# EAGLE design lightsaber (EAGLE 9.6.2)
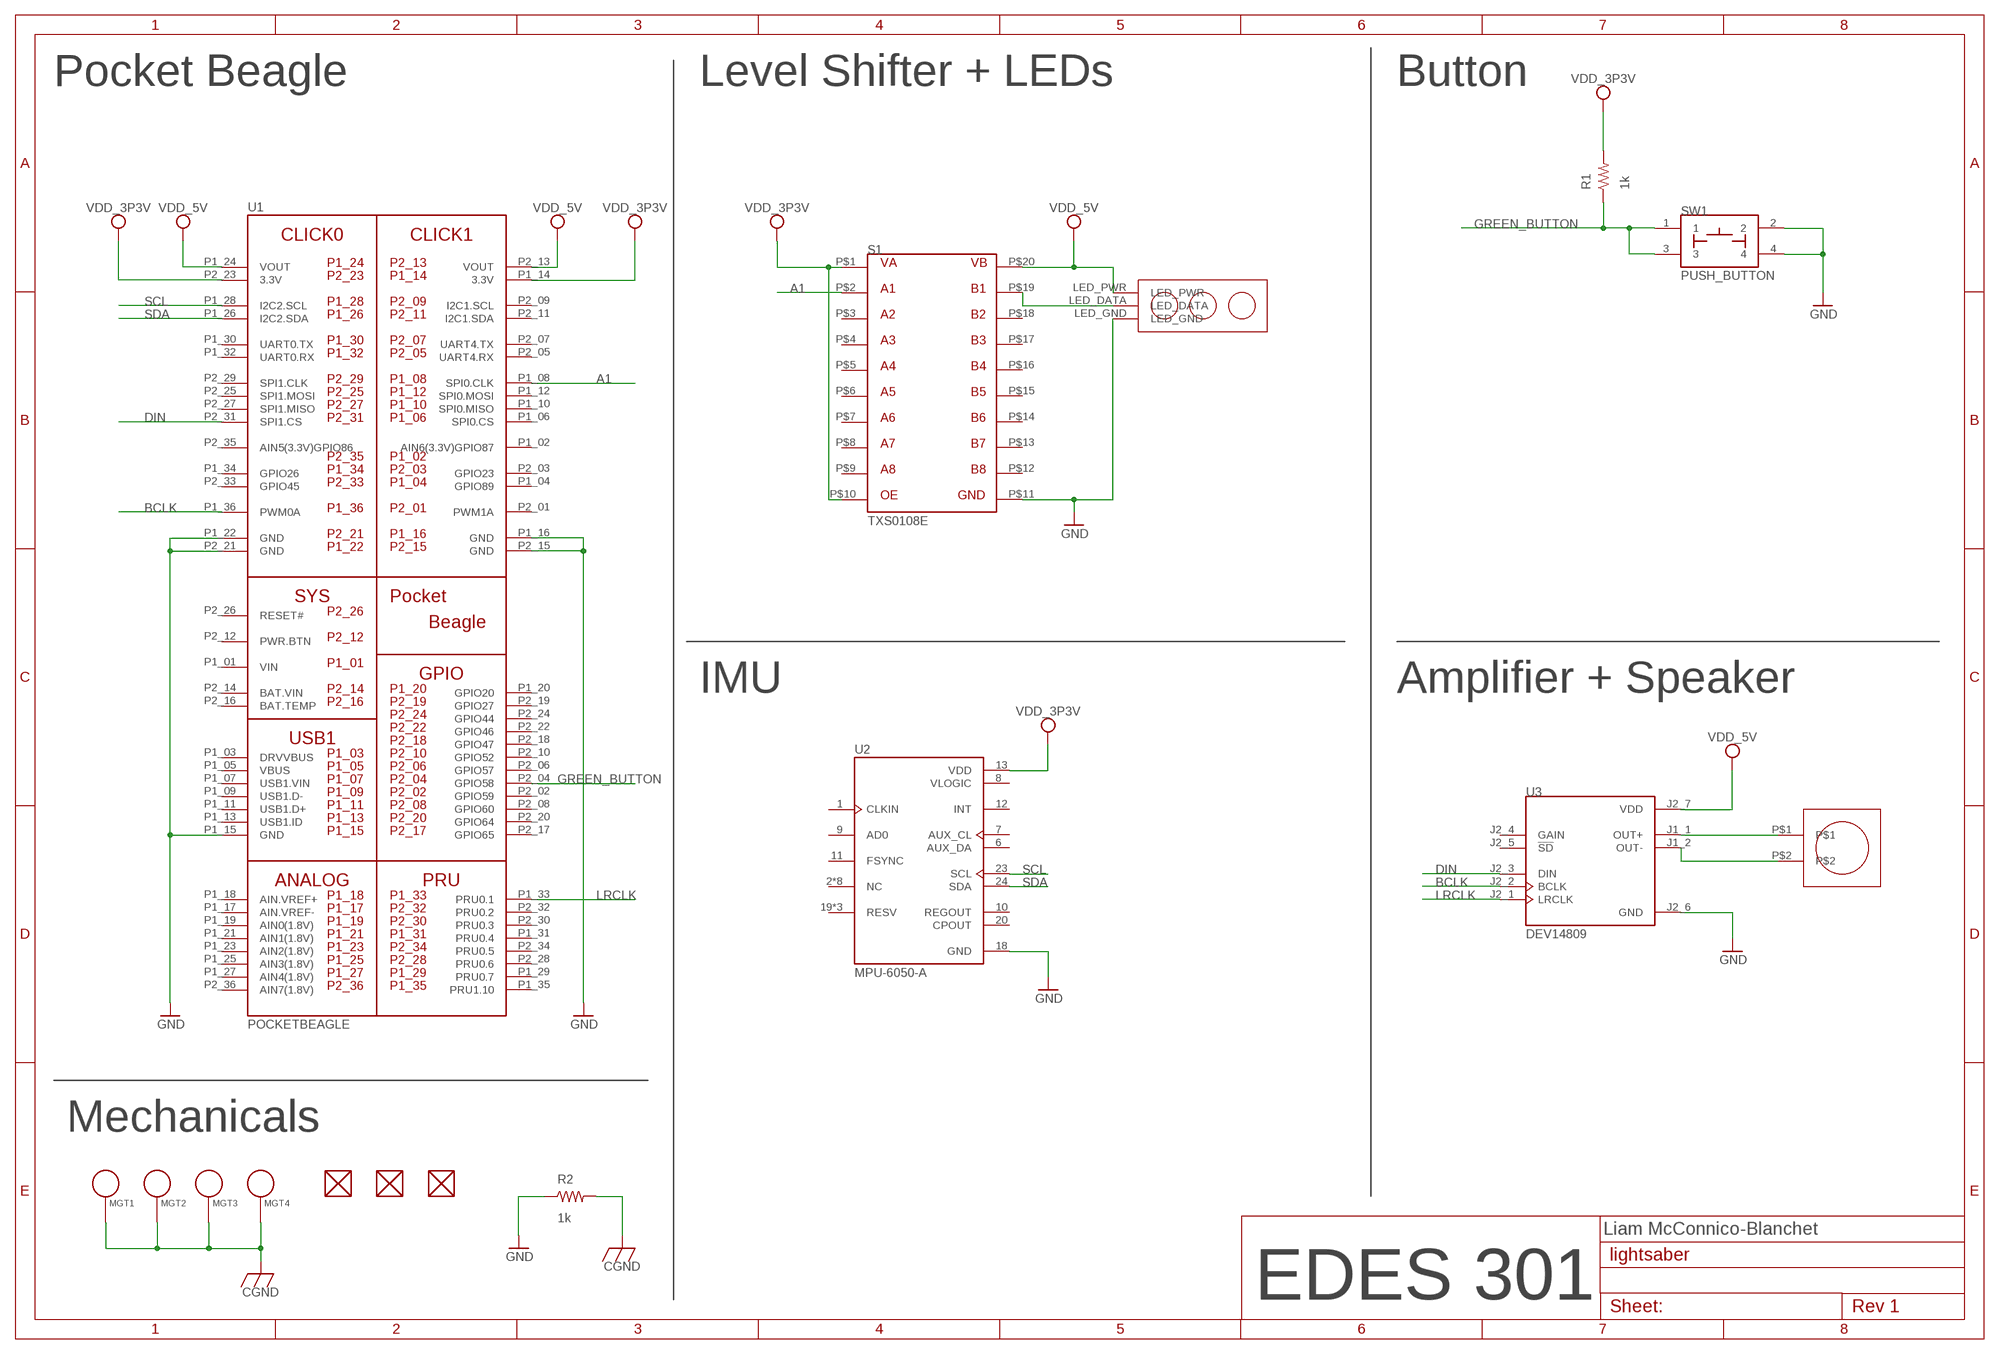
[diagram p0: schematic, sheet 1]

## Parts
FUD1  FIDUCIAL  [FIDUCIAL_40MIL]
FUD2  FIDUCIAL  [FIDUCIAL_40MIL]
FUD3  FIDUCIAL  [FIDUCIAL_40MIL]
MGT1  MOUNTING_HOLE  [MOUNTING_HOLE]
MGT2  MOUNTING_HOLE  [MOUNTING_HOLE]
MGT3  MOUNTING_HOLE  [MOUNTING_HOLE]
MGT4  MOUNTING_HOLE  [MOUNTING_HOLE]
R1  1k  R_R0603  [R0603]
R2  1k  R_R0603  [R0603]
S1  TXS0108E  [TXS0108E]
SW1  PUSH_BUTTON  [BUTTON_12.5MM]
U1  POCKETBEAGLE  [POCKETBEAGLE]
U2  MPU-6050-A  [QFN50P400X400X95-24N]
U3  DEV14809  [MODULE_DEV14809]
U$1  LED_STRIP  [LED_STRIP]
U$2  SPEAKER  [SPEAKER]

## Nets
A1: S1.P$2 U1.P1_08(SPI0.CLK)
BCLK: U1.P1_36(PWM0A) U3.J2_2(BCLK)
CGND: MGT1.P$1 MGT2.P$1 MGT3.P$1 MGT4.P$1 R2.2
DIN: U1.P2_31(SPI1.CS) U3.J2_3(DIN)
GND: R2.1 S1.P$11 SW1.2 SW1.4 U1.P1_15(GND) U1.P1_16(GND) U1.P1_22(GND) U1.P2_15(GND) U1.P2_21(GND) U2.18(GND) U3.J2_6(GND) U$1.LED_GND
GREEN_BUTTON: R1.1 SW1.1 SW1.3 U1.P2_04(GPIO58)
LRCLK: U1.P1_33(PRU0.1) U3.J2_1(LRCLK)
N$1: U3.J1_1(OUT+) U$2.P$1
N$2: U3.J1_2(OUT-) U$2.P$2
N$3: S1.P$19 U$1.LED_DATA
SCL: U1.P1_28(I2C2.SCL) U2.23(SCL)
SDA: U1.P1_26(I2C2.SDA) U2.24(SDA)
VDD_3P3V: R1.2 S1.P$1 S1.P$10 U1.P1_14(3.3V) U1.P2_23(3.3V) U2.13(VDD)
VDD_5V: S1.P$20 U1.P1_24(VOUT) U1.P2_13(VOUT) U3.J2_7(VDD) U$1.LED_PWR
Unconnected: FUD1.P$1 FUD2.P$1 FUD3.P$1 S1.P$3 S1.P$4 S1.P$5 S1.P$6 S1.P$7 S1.P$8 S1.P$9 S1.P$12 S1.P$13 S1.P$14 S1.P$15 S1.P$16 S1.P$17 S1.P$18 U1.P1_02(AIN6(3.3V)GPIO87) U1.P1_03(DRVVBUS) U1.P1_04(GPIO89) U1.P1_05(VBUS) U1.P1_06(SPI0.CS) U1.P1_07(USB1.VIN) U1.P1_09(USB1.D-) U1.P1_10(SPI0.MISO) U1.P1_11(USB1.D+) U1.P1_12(SPI0.MOSI) U1.P1_13(USB1.ID) U1.P1_17(AIN.VREF-) U1.P1_18(AIN.VREF+) U1.P1_19(AIN0(1.8V)) U1.P1_20(GPIO20) U1.P1_21(AIN1(1.8V)) U1.P1_23(AIN2(1.8V)) U1.P1_25(AIN3(1.8V)) U1.P1_27(AIN4(1.8V)) U1.P1_29(PRU0.7) U1.P1_30(UART0.TX) U1.P1_31(PRU0.4) U1.P1_32(UART0.RX) U1.P1_34(GPIO26) U1.P1_35(PRU1.10) U1.P2_01(PWM1A) U1.P2_02(GPIO59) U1.P2_03(GPIO23) U1.P2_05(UART4.RX) U1.P2_06(GPIO57) U1.P2_07(UART4.TX) U1.P2_08(GPIO60) U1.P2_09(I2C1.SCL) U1.P2_10(GPIO52) U1.P2_11(I2C1.SDA) U1.P2_12(PWR.BTN) U1.P2_16(BAT.TEMP) U1.P2_17(GPIO65) U1.P2_18(GPIO47) U1.P2_19(GPIO27) U1.P2_20(GPIO64) U1.P2_22(GPIO46) U1.P2_24(GPIO44) U1.P2_25(SPI1.MOSI) U1.P2_26(RESET#) U1.P2_27(SPI1.MISO) U1.P2_28(PRU0.6) U1.P2_29(SPI1.CLK) U1.P2_30(PRU0.3) U1.P2_32(PRU0.2) U1.P2_33(GPIO45) U1.P2_34(PRU0.5) U1.P2_35(AIN5(3.3V)GPIO86) U1.P2_36(AIN7(1.8V)) U2.1(CLKIN) U2.2(NC) U2.3(NC) U2.4(NC) U2.5(NC) U2.6(AUX_DA) U2.7(AUX_CL) U2.9(AD0) U2.10(REGOUT) U2.11(FSYNC) U2.12(INT) U2.14(NC) U2.15(NC) U2.16(NC) U2.17(NC) U2.19(RESV) U2.20(CPOUT) U2.21(RESV) U2.22(RESV) U3.J2_4(GAIN) U3.J2_5(!SD)

## Notes on the sheet
- Pocket Beagle | Level Shifter + LEDs | Button
- IMU | Amplifier + Speaker
- Mechanicals
- Liam McConnico-Blanchet
- EDES 301

## Power pins joined to a net without a drawn wire
BAT.VIN: U1.P2_14(BAT.VIN)
VIN: U1.P1_01(VIN)
VLOGIC: U2.8(VLOGIC)

## Library data of the parts
FUD1-FUD3 = combo_lock (1):FIDUCIAL
MGT1-MGT4 = combo_lock (1):MOUNTING_HOLE: Chassis Mounting Hole w/GND connection ability
R1 R2 = combo_lock (1):R_: RESISTOR, American symbol
S1 = Project 2:TXS0108E: Level shifter: TXS0108E
SW1 = combo_lock (1):PUSH_BUTTON
U1 = combo_lock (1):POCKETBEAGLE
U2 = Project 2:MPU-6050-A: Check availability <https://pricing.snapeda.com/parts/MPU-6050-A/TDK%20InvenSense/view-part?ref=eda>; AVAILABILITY: In Stock; CHECK_PRICES: https://www.snapeda.com/parts/MPU-6050-A/TDK/view-part/?ref=eda; DESCRIPTION: MOTION TRACKING DEVICE; MF: TDK InvenSense; MP: MPU-6050-A; PACKAGE: QFN-24 InvenSense; PRICE: None; SNAPEDA_LINK: https://www.snapeda.com/parts/MPU-6050-A/TDK/view-part/?ref=snap
U3 = Project 2:DEV14809: Check availability <https://pricing.snapeda.com/parts/DEV14809/Sparkfun%20Electronics/view-part?ref=eda>; AVAILABILITY: In Stock; CHECK_PRICES: https://www.snapeda.com/parts/DEV14809/SparkFun/view-part/?ref=eda; DESCRIPTION: MAX98357A Audio Interface Audio - Platform Evaluation Expansion Board; MF: Sparkfun Electronics; MP: DEV14809; PACKAGE: None; PRICE: None; SNAPEDA_LINK: https://www.snapeda.com/parts/DEV14809/SparkFun/view-part/?ref=snap
U$1 = Project 2:LED_STRIP
U$2 = Project 2:SPEAKER

## Board
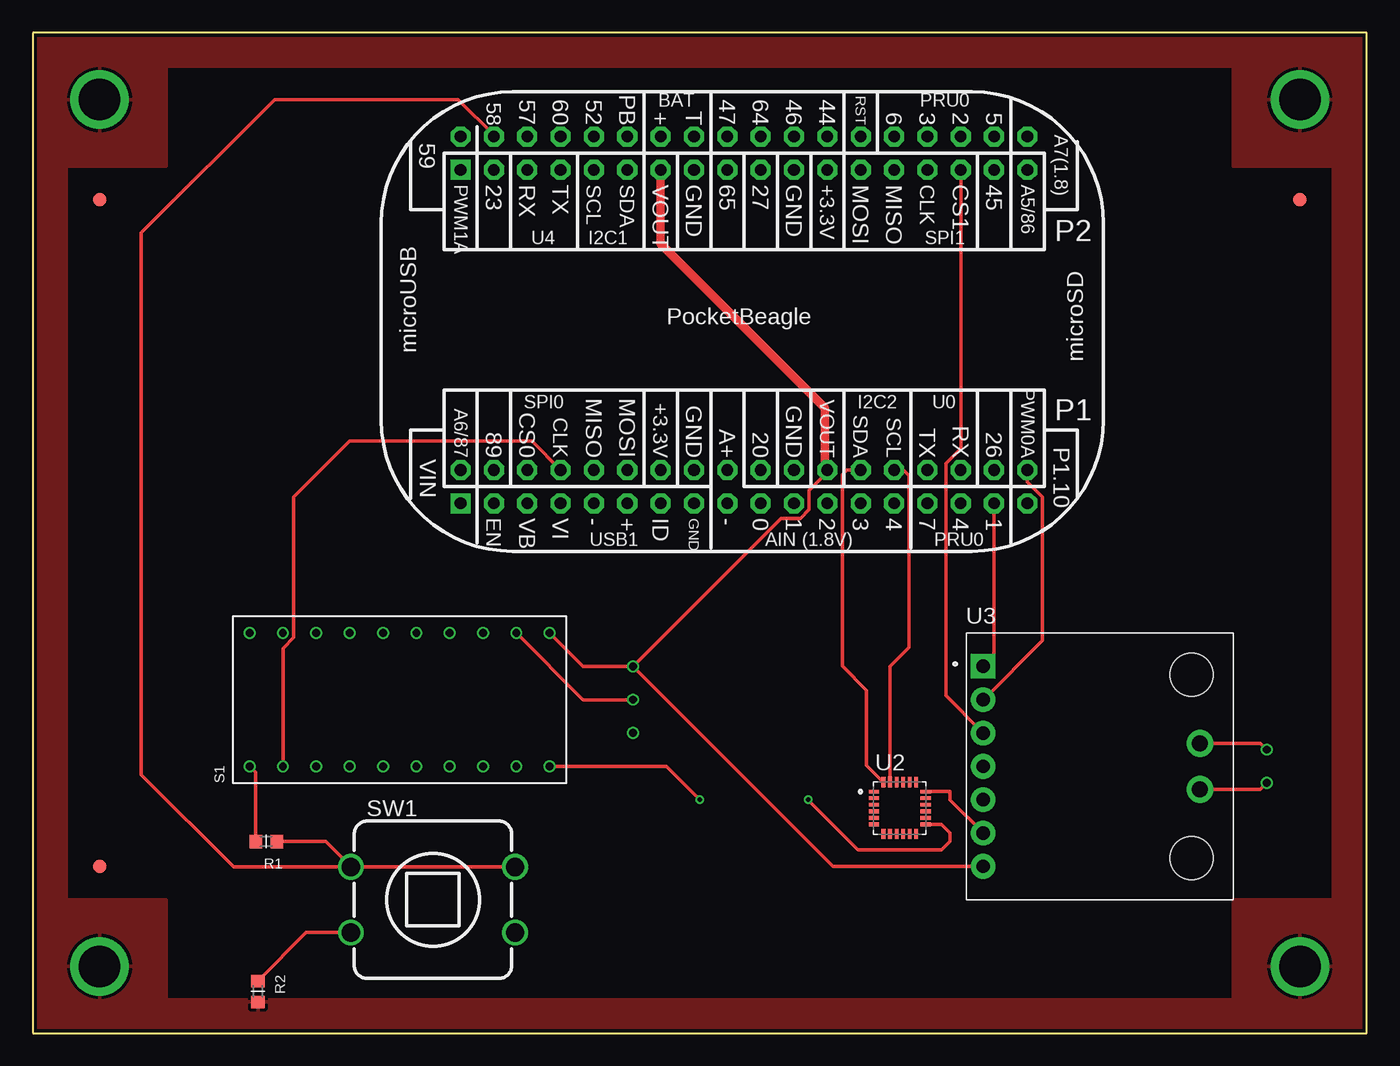
[diagram p1: board, top side]
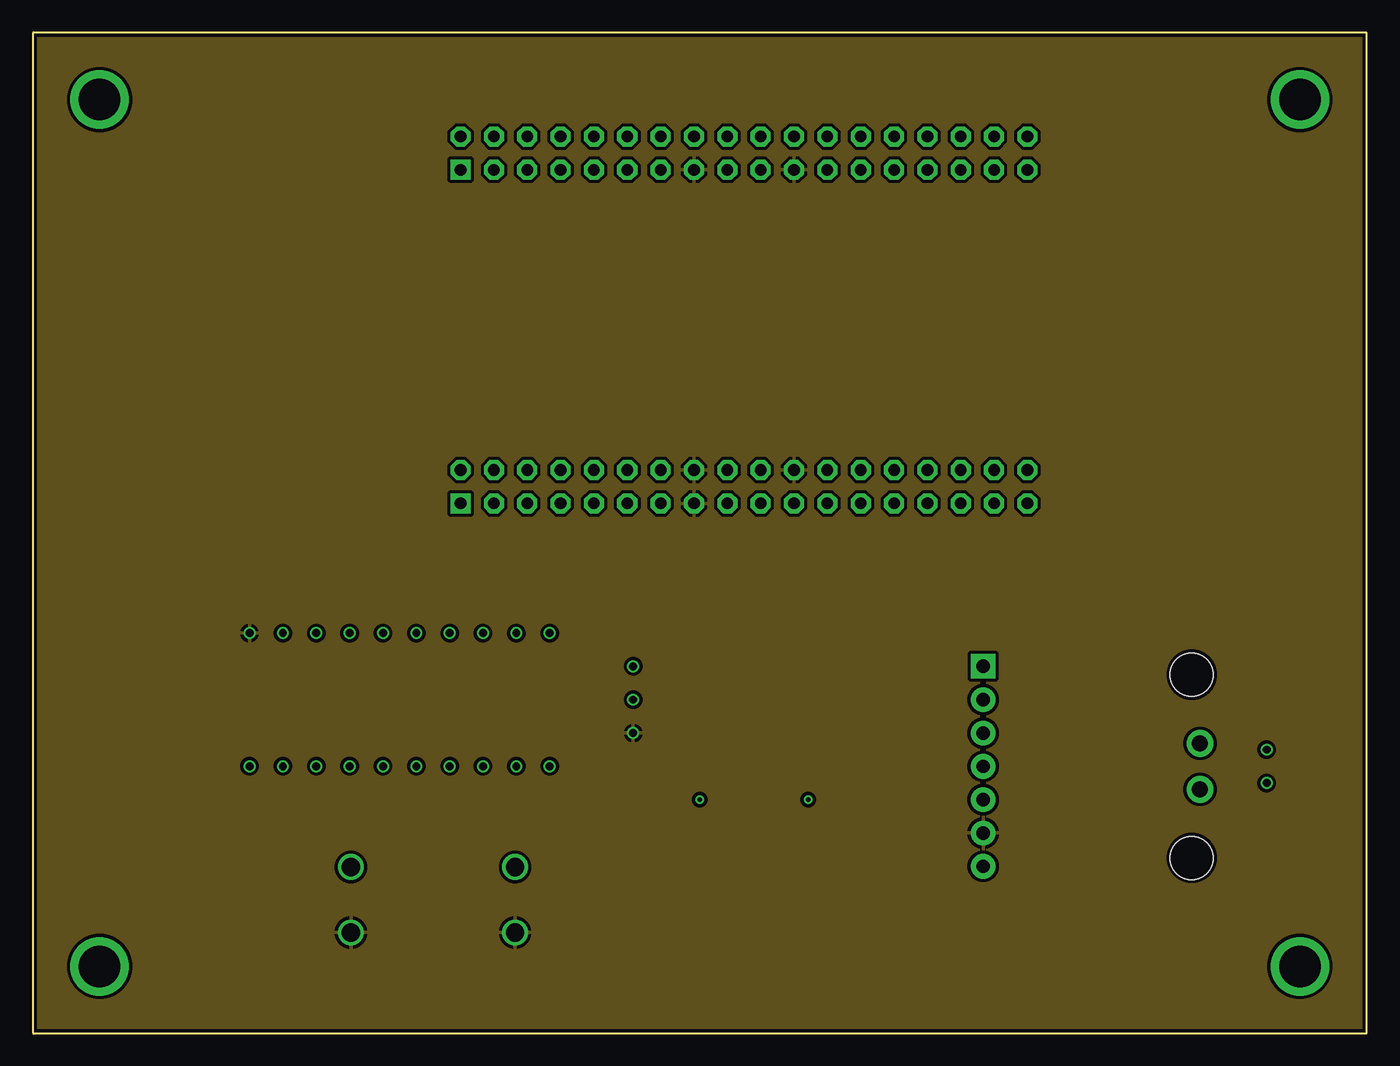
[diagram p2: board, inner layer Route2]
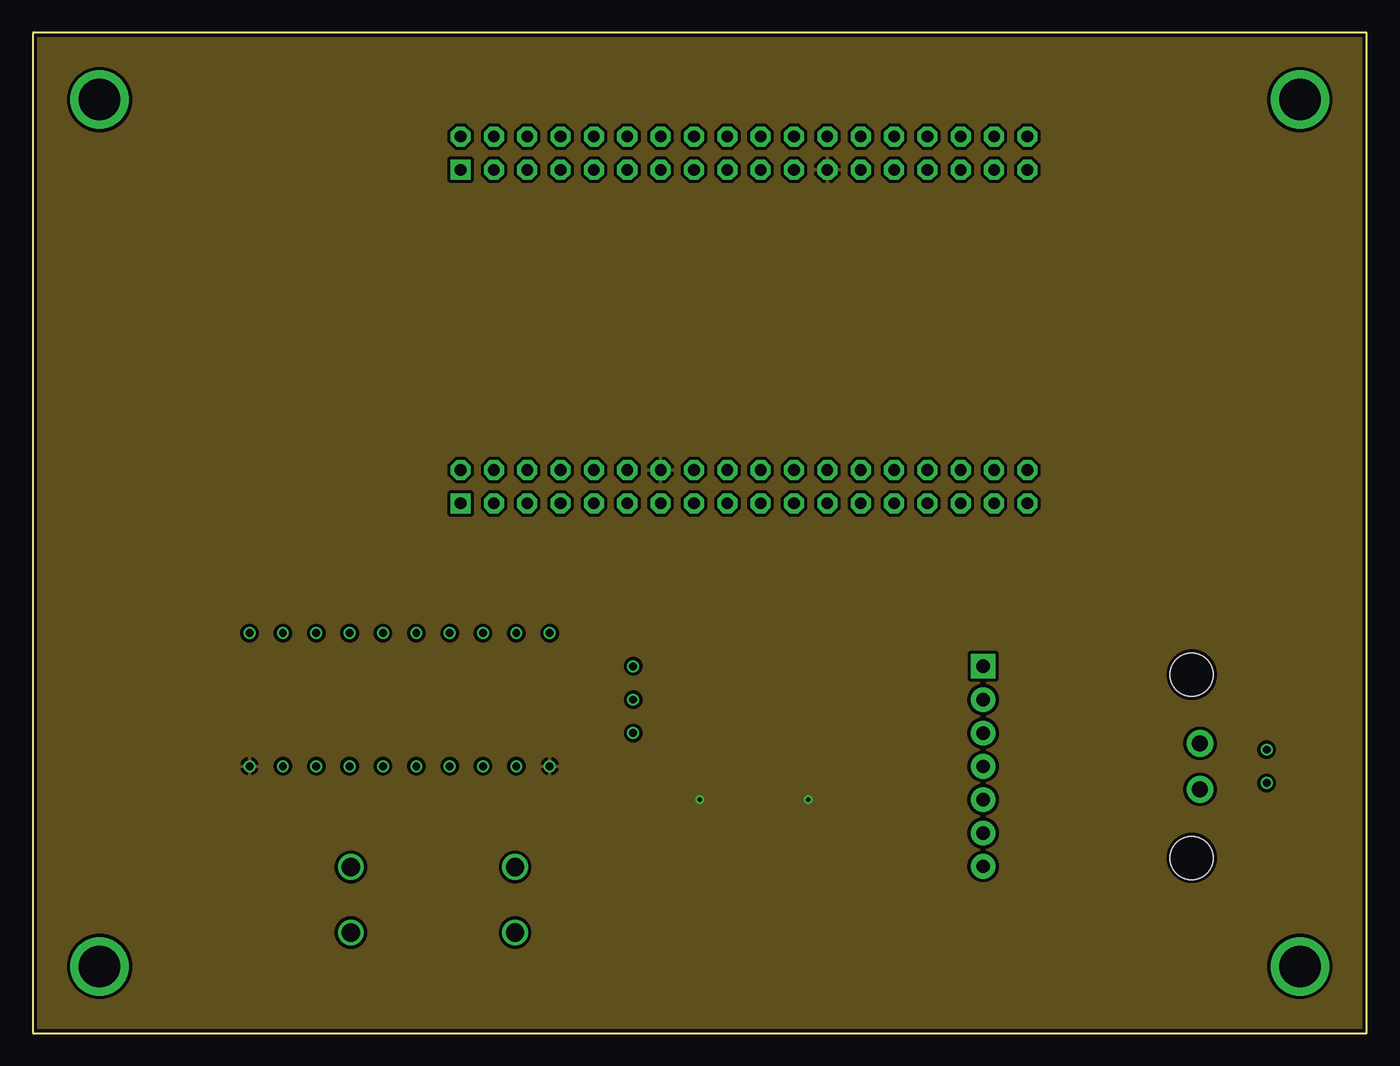
[diagram p3: board, inner layer Route15]
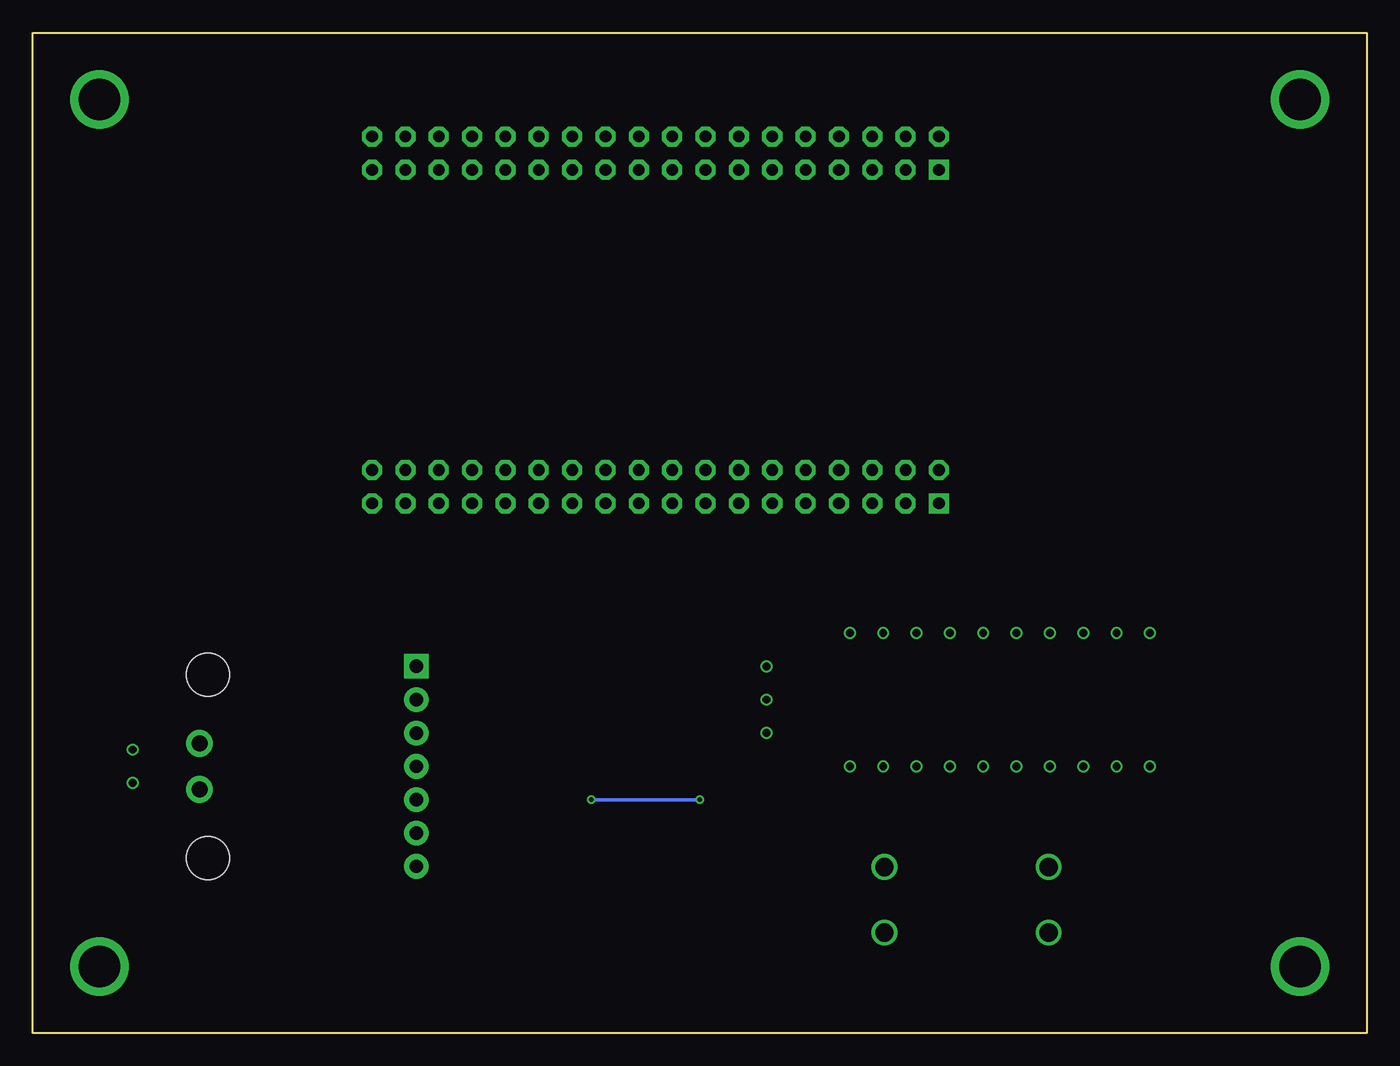
[diagram p4: board, bottom side, seen from below]

Size 101.6 x 76.2 mm. Coordinates in mm from the lower left corner, seen from the top.
Outline: 0,0 101.6,0 101.6,76.2 0,76.2 0,0
Copper layers (1*2*15*16): Top 0.035mm / dielectric 0.23mm / Route2 0.035mm / dielectric 0.93mm / Route15 0.035mm / dielectric 0.23mm / Bottom 0.035mm
Design rules "EDES301_4lyr": minimum track width 10mil, minimum drill 12mil, track to track 10mil, track to pad 10mil, pad to pad 10mil, via to via 10mil, smd to smd 10mil, copper to edge 10mil, drill to drill 12mil, minimum pad ring 6mil, minimum via ring 6mil, stop-mask expansion 3mil, vias tented up to drill 25mil, thermal gap 10mil

### Footprints (pad centres in the part's own frame; a part is rotated, then mirrored left to right if it is on the bottom)
FIDUCIAL_40MIL = smd 1.016 x 1.016: P$1 0,0
MOUNTING_HOLE = drill 3.175 pad 4.445: P$1 0,0
R0603 = smd 0.95 x 1.031: 1 -0.8,0; 2 0.8,0
TXS0108E = drill 0.6: P$1 -5.08,11.43; P$2 -5.08,8.89; P$3 -5.08,6.35; P$4 -5.08,3.81; P$5 -5.08,1.27; P$6 -5.08,-1.27; P$7 -5.08,-3.81; P$8 -5.08,-6.35; P$9 -5.08,-8.89; P$10 -5.08,-11.43; P$11 5.08,11.43; P$12 5.08,8.89; P$13 5.08,6.35; P$14 5.08,3.81; P$15 5.08,1.27; P$16 5.08,-1.27; P$17 5.08,-3.81; P$18 5.08,-6.35; P$19 5.08,-8.89; P$20 5.08,-11.43
BUTTON_12.5MM = drill 1.4: 1 -6.25,2.5; 2 -6.25,-2.5; 3 6.25,2.5; 4 6.25,-2.5
POCKETBEAGLE = drill 0.889 pad 1.524 square: P1_01 5.91,3.53; P2_01 5.91,28.93 | drill 0.889 pad 1.524 octagon: P1_02 5.91,6.07; P1_03 8.45,3.53; P1_04 8.45,6.07; P1_05 10.99,3.53; P1_06 10.99,6.07; P1_07 13.53,3.53; P1_08 13.53,6.07; P1_09 16.07,3.53; P1_10 16.07,6.07; P1_11 18.61,3.53; P1_12 18.61,6.07; P1_13 21.15,3.53; P1_14 21.15,6.07; P1_15 23.69,3.53; P1_16 23.69,6.07; P1_17 26.23,3.53; P1_18 26.23,6.07; P1_19 28.77,3.53; P1_20 28.77,6.07; P1_21 31.31,3.53; P1_22 31.31,6.07; P1_23 33.85,3.53; P1_24 33.85,6.07; P1_25 36.39,3.53; P1_26 36.39,6.07; P1_27 38.93,3.53; P1_28 38.93,6.07; P1_29 41.47,3.53; P1_30 41.47,6.07; P1_31 44.01,3.53; P1_32 44.01,6.07; P1_33 46.55,3.53; P1_34 46.55,6.07; P1_35 49.09,3.53; P1_36 49.09,6.07; P2_02 5.91,31.47; P2_03 8.45,28.93; P2_04 8.45,31.47; P2_05 10.99,28.93; P2_06 10.99,31.47; P2_07 13.53,28.93; P2_08 13.53,31.47; P2_09 16.07,28.93; P2_10 16.07,31.47; P2_11 18.61,28.93; P2_12 18.61,31.47; P2_13 21.15,28.93; P2_14 21.15,31.47; P2_15 23.69,28.93; P2_16 23.69,31.47; P2_17 26.23,28.93; P2_18 26.23,31.47; P2_19 28.77,28.93; P2_20 28.77,31.47; P2_21 31.31,28.93; P2_22 31.31,31.47; P2_23 33.85,28.93; P2_24 33.85,31.47; P2_25 36.39,28.93; P2_26 36.39,31.47; P2_27 38.93,28.93; P2_28 38.93,31.47; P2_29 41.47,28.93; P2_30 41.47,31.47; P2_31 44.01,28.93; P2_32 44.01,31.47; P2_33 46.55,28.93; P2_34 46.55,31.47; P2_35 49.09,28.93; P2_36 49.09,31.47
QFN50P400X400X95-24N = smd 0.79 x 0.28: 1 -1.97,1.25; 2 -1.97,0.75; 3 -1.97,0.25; 4 -1.97,-0.25; 5 -1.97,-0.75; 6 -1.97,-1.25; 13 1.97,-1.25; 14 1.97,-0.75; 15 1.97,-0.25; 16 1.97,0.25; 17 1.97,0.75; 18 1.97,1.25 | smd 0.28 x 0.79: 7 -1.25,-1.97; 8 -0.75,-1.97; 9 -0.25,-1.97; 10 0.25,-1.97; 11 0.75,-1.97; 12 1.25,-1.97; 19 1.25,1.97; 20 0.75,1.97; 21 0.25,1.97; 22 -0.25,1.97; 23 -0.75,1.97; 24 -1.25,1.97
MODULE_DEV14809 = drill 1.2 pad 2.032: J1_1 7.62,-1.75; J1_2 7.62,1.75 | drill 1.016 pad 1.88 square: J2_1 -8.89,7.62 | drill 1.016 pad 1.88: J2_2 -8.89,5.08; J2_3 -8.89,2.54; J2_4 -8.89,0; J2_5 -8.89,-2.54; J2_6 -8.89,-5.08; J2_7 -8.89,-7.62 | hole 3.302: 6.985,6.985; 6.985,-6.985
LED_STRIP = drill 0.6: LED_DATA 0,0; LED_GND 0,-2.54; LED_PWR 0,2.54
SPEAKER = drill 0.6: P$1 0,1.27; P$2 0,-1.27

### Placement (x,y rotation side)
FUD1  5.08,12.7 0 top
FUD2  5.08,63.5 0 top
FUD3  96.52,63.5 0 top
MGT1  96.52,5.08 0 top
MGT2  96.52,71.12 0 top
MGT3  5.08,71.12 0 top
MGT4  5.08,5.08 0 top
R1  17.78,14.61 180 top
R2  17.14,3.17 270 top
S1  27.94,25.4 90 top
SW1  30.48,10.16 0 top
U1  26.67,36.83 0 top
U2  66.04,17.14 0 top
U3  81.28,20.32 0 top
U$1  45.72,25.4 0 top
U$2  93.98,20.32 180 top

### Tracks (layer width: path | path; a pad name or v marks a point on that pad's centre or on a via)
A1
  Top 0.254: U1.P1_08 38.02,45.09 24.13,45.09 19.88,40.84 19.88,30.14 19.05,29.3 S1.P$2
BCLK
  Top 0.254: U1.P1_36 75.76,41.98 76.9,40.83 76.9,29.91 U3.J2_2
CGND
  pour Top: -2.54,38.1 2.54,38.1 2.54,10.16 10.16,10.16 10.16,2.54 91.44,2.54 91.44,10.16 99.06,10.16 99.06,38.1 104.14,38.1 104.14,-2.54 -2.54,-2.54
  pour Top: -2.54,38.1 -2.54,78.74 104.14,78.74 104.14,38.1 99.06,38.1 99.06,66.04 91.44,66.04 91.44,73.66 10.16,73.66 10.16,66.04 2.54,66.04 2.54,38.1
DIN
  Top 0.254: U3.J2_3 71.12,24.13 70.68,24.57 69.54,25.71 69.54,43.37 70.68,44.52 U1.P2_31
GND
  Top 0.254: R2.1 20.83,7.66 SW1.2 | U3.J2_6 69.85,17.78 69.85,18.39 U2.18
  pour Route2: -5.08,-5.08 -5.08,81.28 106.68,81.28 106.68,-5.08
GREEN_BUTTON
  Top 0.254: SW1.1 SW1.3 | U1.P2_04 35.12,68.39 32.38,71.12 18.41,71.12 8.26,60.96 8.26,19.68 15.28,12.66 SW1.1 | R1.1 22.29,14.61 SW1.1
LRCLK
  Top 0.254: U3.J2_1 73.22,28.77 U1.P1_33
N$1
  Top 0.254: U$2.P$1 93.5,18.57 U3.J1_1
N$2
  Top 0.254: U3.J1_2 93.5,22.07 U$2.P$2
N$3
  Top 0.254: S1.P$19 41.91,25.4 U$1.LED_DATA
SCL
  Top 0.254: U1.P1_28 66.32,42.9 66.74,42.48 66.74,29.4 65.29,27.94 U2.23
SDA
  Top 0.254: U1.P1_26 62.02,42.9 61.66,42.55 61.66,27.96 63.5,26.12 63.5,20.41 U2.24
VDD_3P3V  (via drill 0.35)
  Top 0.254: S1.P$1 16.98,19.85 R1.2 | S1.P$10 48.26,20.32 v50.8,17.78 | v59.05,17.78 62.87,13.97 69.22,13.97 69.85,14.61 69.85,15.24 69.19,15.89 U2.13
  Bottom 0.254: v50.8,17.78 v59.05,17.78
  pour Route15: -7.62,-7.62 -7.62,83.82 109.22,83.82 109.22,-7.62
VDD_5V
  Top 0.254: U1.P1_24 60.52,42.74 59.12,41.34 59.12,39.89 58.45,39.22 57,39.22 U$1.LED_PWR | U$1.LED_PWR 41.91,27.94 S1.P$20 | U$1.LED_PWR 60.96,12.7 U3.J2_7
  Top 0.635: U1.P2_13 47.82,60.13 60.33,47.62 60.33,43.09 U1.P1_24